# Altium project sensor_board.PrjPcb
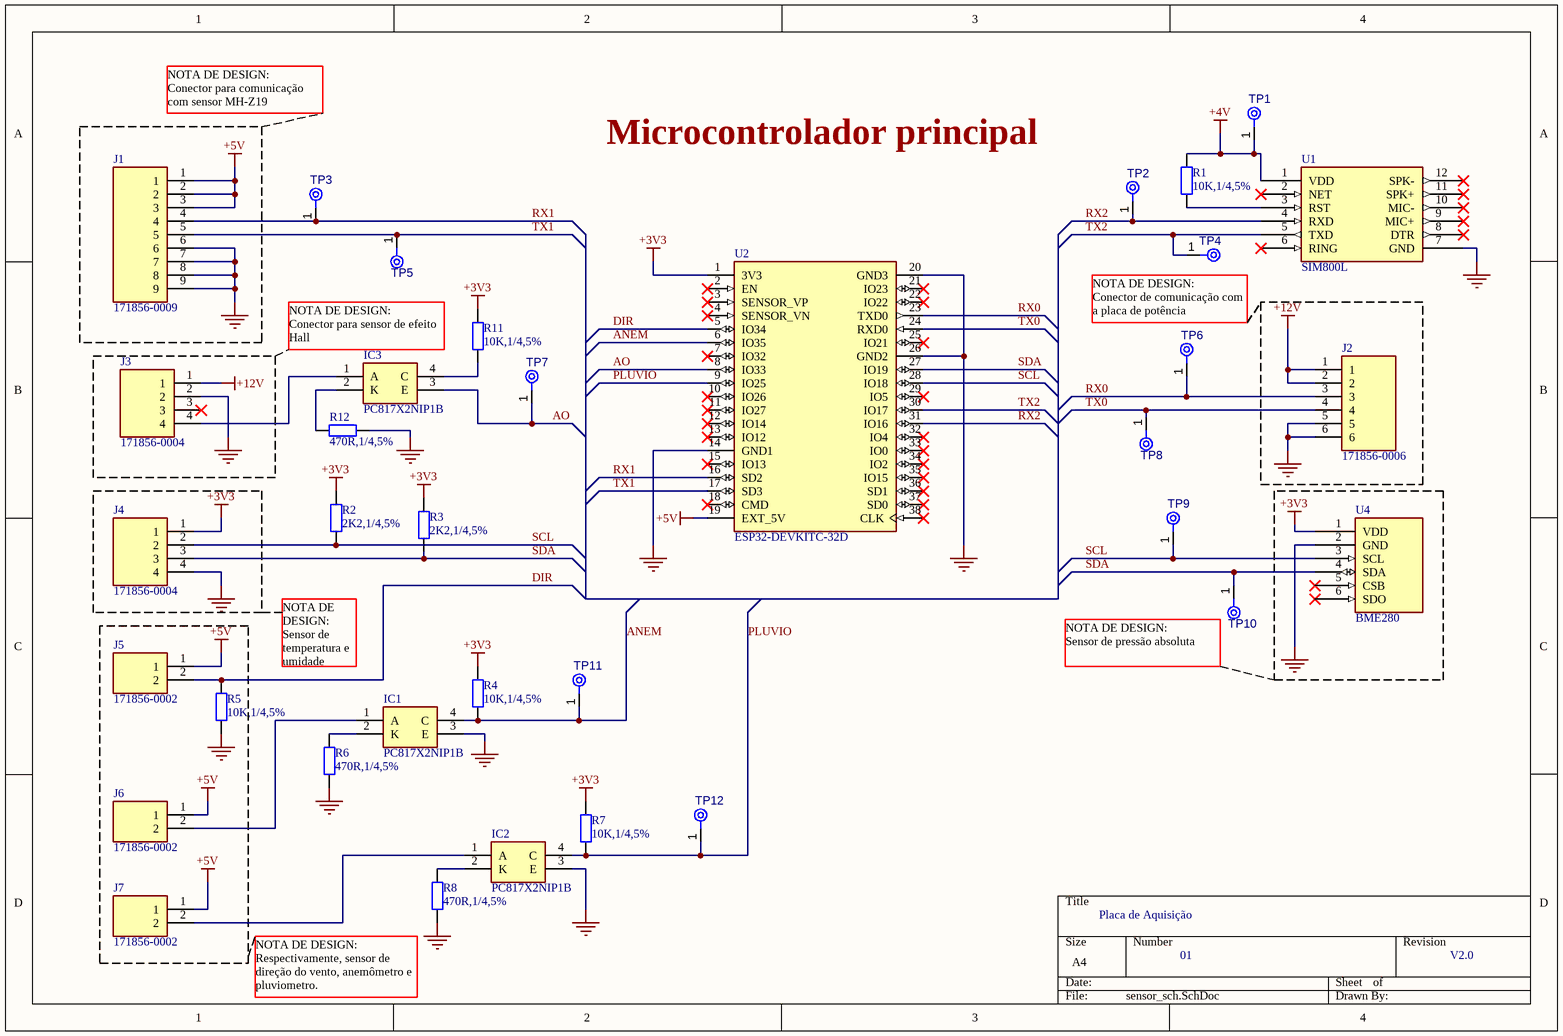
[diagram p0: sensor_sch.SchDoc]
2 sheets, 51 parts. Net scope: global (net labels, ports and power ports of the same name join across sheets).
Board file: sensor_board.PcbDoc
Sheets:
  sensor_sch.SchDoc
  voltage_regulators.SchDoc

## Sheet sensor_sch.SchDoc
size A4; SheetNumber: 1; SheetTotal: 2

### Parts
IC1  PC817X2NIP1B  [SOP254P960X420-4N]
IC2  PC817X2NIP1B  [SOP254P960X420-4N]
IC3  PC817X2NIP1B  [SOP254P960X420-4N]
J1  171856-0009  [SHDR9W99P0X254_1X9_2271X635X818P]
J2  171856-0006  [HDRV6W99P0X254_1X6_1509X635X1100P]
J3  171856-0004  [SHDR4W99P0X254_1X4_1255X635X1124P]
J4  171856-0004  [SHDR4W99P0X254_1X4_1255X635X1124P]
J5  171856-0002  [SHDR2W99P0X254_1X2_493X635X818P]
J6  171856-0002  [SHDR2W99P0X254_1X2_493X635X818P]
J7  171856-0002  [SHDR2W99P0X254_1X2_493X635X818P]
R1  value 10K,1/4,5%  [RESC3216X60N]  (hidden comment: Res2)
R2  value 2K2,1/4,5%  [RESC3216X60N]  (hidden comment: Res2)
R3  value 2K2,1/4,5%  [RESC3216X60N]  (hidden comment: Res2)
R4  value 10K,1/4,5%  [RESC3216X60N]  (hidden comment: Res2)
R5  value 10K,1/4,5%  [RESC3216X60N]  (hidden comment: Res2)
R6  value 470R,1/4,5%  [RESC3216X60N]  (hidden comment: Res2)
R7  value 10K,1/4,5%  [RESC3216X60N]  (hidden comment: Res2)
R8  value 470R,1/4,5%  [RESC3216X60N]  (hidden comment: Res2)
R11  value 10K,1/4,5%  [RESC3216X60N]  (hidden comment: Res2)
R12  value 470R,1/4,5%  [RESC3216X60N]  (hidden comment: Res2)
TP1  TPAD6R  [TP06R]  (value not drawn)  (no BOM)
TP2  TPAD6R  [TP06R]  (value not drawn)  (no BOM)
TP3  TPAD6R  [TP06R]  (value not drawn)  (no BOM)
TP4  TPAD6R  [TP06R]  (value not drawn)  (no BOM)
TP5  TPAD6R  [TP06R]  (value not drawn)  (no BOM)
TP6  TPAD6R  [TP06R]  (value not drawn)  (no BOM)
TP7  TPAD6R  [TP06R]  (value not drawn)  (no BOM)
TP8  TPAD6R  [TP06R]  (value not drawn)  (no BOM)
TP9  TPAD6R  [TP06R]  (value not drawn)  (no BOM)
TP10  TPAD6R  [TP06R]  (value not drawn)  (no BOM)
TP11  TPAD6R  [TP06R]  (value not drawn)  (no BOM)
TP12  TPAD6R  [TP06R]  (value not drawn)  (no BOM)
U1  SIM800L  [SIM800L]
U2  ESP32-DEVKITC-32D  [MODULE_ESP32-DEVKITC-32D]
U4  BME280  [BME280]

### Nets
+3V3: J4.1 R2.2 R3.2 R4.2 R7.2 R11.2 U2.1(3V3) U4.1(VDD)
+4V: R1.2 TP1.1(TP) U1.1(VDD)
+5V: J1.1 J1.2 J1.3 J5.1 J6.1 J7.1 U2.19(EXT_5V)
+12V: J2.1 J2.2 J3.1
GND: IC1.3(E) IC2.3(E) J1.6 J1.7 J1.8 J1.9 J2.5 J2.6 J3.2 J4.4 R5.1 R6.1 R8.1 R12.1 U1.7(GND) U2.14(GND1) U2.20(GND3) U2.26(GND2) U4.2(GND)
ANEM: IC1.4(C) R4.1 TP11.1(TP) U2.6(IO35)
AO: IC3.3(E) TP7.1(TP) U2.8(IO33)
DIR: J5.2 R5.2 U2.5(IO34)
PLUVIO: IC2.4(C) R7.1 TP12.1(TP) U2.9(IO25)
RX0: J2.3 TP6.1(TP) U2.23(TXD0)
RX1: J1.4 TP3.1(TP) U2.16(SD2)
RX2: TP2.1(TP) U1.4(RXD) U2.31(IO16)
SCL: J4.2 R2.1 TP9.1(TP) U2.28(IO18) U4.3(SCL)
SDA: J4.3 R3.1 TP10.1(TP) U2.27(IO19) U4.4(SDA)
TX0: J2.4 TP8.1(TP) U2.24(RXD0)
TX1: J1.5 TP5.1(TP) U2.17(SD3)
TX2: TP4.1(TP) U1.5(TXD) U2.30(IO17)
NetIC1_1: IC1.1(A) J6.2
NetIC1_2: IC1.2(K) R6.2
NetIC2_1: IC2.1(A) J7.2
NetIC2_2: IC2.2(K) R8.2
NetIC3_1: IC3.1(A) J3.4
NetIC3_2: IC3.2(K) R12.2
NetIC3_4: IC3.4(C) R11.1
NetR1_1: R1.1 U1.3(RST)

Not connected (* = marked no-connect by the designer): J3 3*; U1 2(NET)* 6(RING)* 8(DTR)* 9(MIC+)* 10(MIC-)* 11(SPK+)* 12(SPK-)*; U2 2(EN)* 3(SENSOR_VP)* 4(SENSOR_VN)* 7(IO32)* 10(IO26)* 11(IO27)* 12(IO14)* 13(IO12)* 15(IO13)* 18(CMD)* 21(IO23)* 22(IO22)* 25(IO21)* 29(IO5)* 32(IO4)* 33(IO0)* 34(IO2)* 35(IO15)* 36(SD1)* 37(SD0)* 38(CLK)*; U4 5(CSB)* 6(SDO)*

### Notes on the sheet
- NOTA DE DESIGN:
  Conector para comunicação com sensor MH-Z19
- Microcontrolador principal
- NOTA DE DESIGN:
  Conector para sensor de efeito Hall
- (near TP4) NOTA DE DESIGN:
  Conector de comunicação com a placa de potência
- NOTA DE DESIGN:
  Sensor de temperatura e umidade
- (near TP10) NOTA DE DESIGN:
  Sensor de pressão absoluta
- Placa de Aquisição
- 01
- V2.0
- (near R8) NOTA DE DESIGN:
  Respectivamente, sensor de direção do vento, anemômetro e pluviometro.

### Library data of the parts
IC1-IC3 = PC817X2NIP1B: Transistor Output Optocouplers Photocoupler; Manufacturer_Name: Sharp Microelectronics; Manufacturer: Sharp; Datasheet Link: https://global.sharp/products/device/lineup/data/pdf/datasheet/PC817XxNSZ1B_e.pdf; Height: 4.2mm; Manufacturer_Part_Number: PC817X2NIP1B; Mouser Part Number: 852-PC817X2NIP1B; Mouser Price/Stock: https://www.mouser.co.uk/ProductDetail/Sharp-Microelectronics/PC817X2NIP1B?qs=rrS6PyfT74d%252BYyTnGmD7xQ%3D%3D; Arrow Part Number: PC817X2NIP1B; Arrow Price/Stock: https://www.arrow.com/en/products/pc817x2nip1b/sharp; Supplier 1: Mouser; Supplier Part Number 1: 852-PC817X2NIP1B; Manufacturer Part Number: PC817X2NIP1B; RoHS: Yes; Category: Optocouplers; Stock 1: 7; Pricing 1: 1=0.51000, 10=0.33400, 50=0.33400, 100=0.21900, 1000=0.17300, 10000=0.14100 (USD); RoHS Compliant: Yes
J1 = 171856-0009: Headers & Wire Housings KK Hdr Vrt 9 Ckt 2.54mm Pitch Sn; Manufacturer_Name: Molex; Manufacturer Part Number: 1718560009; Current Rating: 4A; Voltage Rating: 250V; Number of Positions: 9; Connector Type: Male Pin; Contact Post Length: 2.34mm; Glow Wire Compliant: Compliant; Datasheet Link: https://www.molex.com/pdm_docs/sd/1718560009_sd.pdf; Height: 8.18mm; Manufacturer_Part_Number: 171856-0009; Mouser Part Number: 538-171856-0009; Mouser Price/Stock: https://www.mouser.com/Search/Refine.aspx?Keyword=538-171856-0009; Supplier 1: Digi-Key; Supplier Part Number 1: WM10186-ND; Manufacturer: Molex; RoHS: Yes; Category: Headers and Wire Housings; Stock 1: 1734; Pricing 1: 1=0.83000, 10=0.68600, 100=0.57150, 1000=0.45717, 5000=0.40002, 10000=0.38002 (USD); Mount: Through Hole; Contact Plating: Tin; Contact Material: Brass; Color: Black; Housing Material: Nylon; Weight: 0.036367oz; Min Operating Temperature: -40°C; Max Operating Temperature: 105°C; Package Quantity: 1000; Number of Rows: 1; Contact Gender: Male; Packaging: Bulk; Fastening Type: Friction; Termination: Solder; Orientation: Vertical; Number of Circuits: 9; Pitch: 2.54mm; Contact Mating Length: 0.293inch; Flammability Rating: UL94 V-2; Halogen Free: Low Halogen; RoHS Compliant: Yes; ComponentLink1URL: https://datasheet.ciiva.com/24242/1718560009-pcb-headers-262932-24242129.pdf?src-supplier=Mouser; ComponentLink1Description: https://datasheet.ciiva.com/24242/1718560009-pcb-headers-262932-24242129.pdf?src-supplier=Mouser
J2 = 171856-0006: Conn Wire to Board HDR 6 POS 2.54mm Solder ST Thru-Hole KK® Bag; Manufacturer_Name: Molex; Current Rating: 4A; Voltage Rating: 250V; Number of Positions: 6; Gender: Male; Connector Type: Male Pin; Contact Post Length: 2.34mm; Glow Wire Compliant: Compliant; Datasheet Link: https://www.molex.com/pdm_docs/sd/1718560006_sd.pdf; Height: 11mm; Manufacturer_Part_Number: 171856-0006; Mouser Part Number: 538-171856-0006; Mouser Price/Stock: https://www.mouser.co.uk/ProductDetail/Molex/171856-0006?qs=s7UCm7gO1bZ%2FF4kPA9T7bA%3D%3D; Supplier 1: Mouser; Supplier Part Number 1: 538-171856-0006; Manufacturer: Molex; Manufacturer Part Number: 171856-0006; RoHS: Yes; Category: Headers and Wire Housings; Stock 1: 7801; Pricing 1: 1=0.52000, 10=0.44100, 50=0.44100, 100=0.34400, 1000=0.27000, 10000=0.22000 (USD); Mount: Through Hole; Contact Plating: Tin,Matte; Contact Material: Brass,Tin; Color: Black; Housing Color: Black; Housing Material: Nylon; Weight: 0.023916oz; Min Operating Temperature: -40°C; Max Operating Temperature: 105°C; Number of Rows: 1; Contact Gender: Male; Packaging: Bulk; Package Quantity: 2000; Fastening Type: Friction; Termination: Solder; Number of Contacts: 6; Orientation: Vertical; Number of Circuits: 6; Length: 15.09mm; Pitch: 2.54mm; Contact Mating Length: 0.293inch; Depth: 6.35mm; Radiation Hardening: No; REACH SVHC: Unknown; Halogen Free: Low Halogen; Flammability Rating: UL94 V-2; RoHS Compliant: Yes; ComponentLink1URL: https://datasheet.ciiva.com/24135/1718560006-pcb-headers-295618-24135976.pdf?src-supplier=Mouser; ComponentLink1Description: https://datasheet.ciiva.com/24135/1718560006-pcb-headers-295618-24135976.pdf?src-supplier=Mouser; ComponentLink2URL: https://datasheet.ciiva.com/30069/162461718560006-pcb-headers-30069863.pdf?src-supplier=Onlinecomponents.com; ComponentLink2Description: https://datasheet.ciiva.com/30069/162461718560006-pcb-headers-30069863.pdf?src-supplier=Onlinecomponents.com; ComponentLink3URL: https://datasheet.ciiva.com/28500/1769843-28500365.pdf?src-supplier=Element14; ComponentLink3Description: https://datasheet.ciiva.com/28500/1769843-28500365.pdf?src-supplier=Element14; ComponentLink4URL: https://datasheet.ciiva.com/30492/0900766b8129e59b-30492739.pdf?src-supplier=RSComponents; ComponentLink4Description: https://datasheet.ciiva.com/30492/0900766b8129e59b-30492739.pdf?src-supplier=RSComponents; ComponentLink5URL: https://datasheet.ciiva.com/29948/1718560002-sd-29948527.pdf?src-supplier=Avnet; ComponentLink5Description: https://datasheet.ciiva.com/29948/1718560002-sd-29948527.pdf?src-supplier=Avnet; ComponentLink6URL: https://datasheet.ciiva.com/30514/70314281-30514598.pdf?src-supplier=Allied+Electronics; ComponentLink6Description: https://datasheet.ciiva.com/30514/70314281-30514598.pdf?src-supplier=Allied+Electronics
J3 J4 = 171856-0004: KK RPC 100 HDR FRLK VERT 04 CKT; Manufacturer: Molex; Manufacturer Part Number: 1718560004; Current Rating: 4A; Voltage Rating: 250V; Number of Positions: 4; Gender: Male; Connector Type: Male Pin; Pitch: 2.54mm; Contact Post Length: 2.34mm; Glow Wire Compliant: Compliant; Supplier 1: Mouser; RoHS: Yes; Category: Headers and Wire Housings; Stock 1: 33104; Pricing 1: 1=0.40000, 10=0.32400, 50=0.32400, 100=0.23800, 1000=0.20000, 10000=0.15600 (USD); Mount: Through Hole; Contact Plating: Tin,Matte; Contact Material: Brass,Tin; Color: Black; Weight: 0.015838oz; Housing Color: Black; Housing Material: Nylon; Min Operating Temperature: -40°C; Max Operating Temperature: 105°C; Number of Rows: 1; Contact Gender: Male; Packaging: Bulk; Package Quantity: 4000; Fastening Type: Friction; Termination: Solder; Number of Contacts: 4; Orientation: Vertical; Number of Circuits: 4; Length: 10.1mm; Contact Mating Length: 0.293inch; Depth: 6.35mm; Radiation Hardening: No; REACH SVHC: Unknown; Halogen Free: Low Halogen; Flammability Rating: UL94 V-2; RoHS Compliant: Yes; ComponentLink1URL: https://datasheet.ciiva.com/24135/1718560004-pcb-headers-295616-24135986.pdf?src-supplier=Mouser; ComponentLink1Description: https://datasheet.ciiva.com/24135/1718560004-pcb-headers-295616-24135986.pdf?src-supplier=Mouser; ComponentLink2URL: https://datasheet.ciiva.com/30102/162471718560004-pcb-headers-30102326.pdf?src-supplier=Onlinecomponents.com; ComponentLink2Description: https://datasheet.ciiva.com/30102/162471718560004-pcb-headers-30102326.pdf?src-supplier=Onlinecomponents.com; ComponentLink3URL: https://datasheet.ciiva.com/30492/0900766b8129e622-30492729.pdf?src-supplier=RSComponents; ComponentLink3Description: https://datasheet.ciiva.com/30492/0900766b8129e622-30492729.pdf?src-supplier=RSComponents; ComponentLink4URL: https://datasheet.ciiva.com/28500/1769844-28500352.pdf?src-supplier=Element14; ComponentLink4Description: https://datasheet.ciiva.com/28500/1769844-28500352.pdf?src-supplier=Element14; ComponentLink5URL: https://datasheet.ciiva.com/29948/1718560002-sd-29948535.pdf?src-supplier=Avnet; ComponentLink5Description: https://datasheet.ciiva.com/29948/1718560002-sd-29948535.pdf?src-supplier=Avnet; ComponentLink6URL: https://datasheet.ciiva.com/29152/1718560002-sd-29152029.pdf?src-supplier=Digi-Key; ComponentLink6Description: https://datasheet.ciiva.com/29152/1718560002-sd-29152029.pdf?src-supplier=Digi-Key; ComponentLink7URL: https://datasheet.ciiva.com/30935/70314280-30935659.pdf?src-supplier=Allied+Electronics; ComponentLink7Description: https://datasheet.ciiva.com/30935/70314280-30935659.pdf?src-supplier=Allied+Electronics; Supplier 2: Mouser; Supplier Part Number 2: 538-171856-0004; Stock 2: 33061; Pricing 2: 1=0.40000, 10=0.32400, 50=0.32400, 100=0.23800, 1000=0.20000, 10000=0.15600 (USD)
J5-J7 = 171856-0002: Conn Wire to Board HDR 2 POS 2.54mm Solder ST Thru-Hole KK® Bag; Manufacturer_Name: Molex; Current Rating: 4A; Voltage Rating: 250V; Number of Positions: 2; Gender: Male; Connector Type: Male Pin; Contact Post Length: 2.34mm; Glow Wire Compliant: Compliant; Datasheet Link: https://www.digikey.com/product-detail/en/molex/1718560002/WM10153-ND/4423109; Height: 8.18mm; Manufacturer_Part_Number: 171856-0002; Mouser Part Number: 538-171856-0002; Mouser Price/Stock: https://www.mouser.co.uk/ProductDetail/Molex/171856-0002?qs=s7UCm7gO1bYKeEMrirBzyw%3D%3D; Arrow Part Number: 171856-0002; Arrow Price/Stock: https://www.arrow.com/en/products/171856-0002/molex; Supplier 1: Mouser; Supplier Part Number 1: 538-171856-0002; Manufacturer: Molex; Manufacturer Part Number: 171856-0002; RoHS: Yes; Category: Headers and Wire Housings; Stock 1: 4493; Pricing 1: 1=0.27000, 10=0.22200, 50=0.22200, 100=0.16300, 1000=0.13000, 10000=0.10000 (USD); Mount: Through Hole; Contact Plating: Tin,Matte; Contact Material: Brass,Tin; Color: Black; Housing Color: Black; Housing Material: Nylon; Weight: 0.007549oz; Min Operating Temperature: -40°C; Max Operating Temperature: 105°C; Number of Rows: 1; Packaging: Bulk; Contact Gender: Male; Package Quantity: 6000; Fastening Type: Friction; Termination: Solder; Number of Contacts: 2; Orientation: Vertical; Number of Circuits: 2; Length: 4.93mm; Pitch: 2.54mm; Contact Mating Length: 0.293inch; Depth: 6.35mm; Radiation Hardening: No; REACH SVHC: Unknown; Halogen Free: Low Halogen; Flammability Rating: UL94 V-2; ComponentLink1URL: https://datasheet.ciiva.com/24135/1718560002-pcb-headers-262931-24135970.pdf?src-supplier=Mouser; ComponentLink1Description: https://datasheet.ciiva.com/24135/1718560002-pcb-headers-262931-24135970.pdf?src-supplier=Mouser; ComponentLink2URL: https://datasheet.ciiva.com/30239/162441718560002-pcb-headers-30239327.pdf?src-supplier=Onlinecomponents.com; ComponentLink2Description: https://datasheet.ciiva.com/30239/162441718560002-pcb-headers-30239327.pdf?src-supplier=Onlinecomponents.com; ComponentLink3URL: https://datasheet.ciiva.com/28500/1769839-28500337.pdf?src-supplier=Element14; ComponentLink3Description: https://datasheet.ciiva.com/28500/1769839-28500337.pdf?src-supplier=Element14; ComponentLink4URL: https://datasheet.ciiva.com/30492/0900766b8129e621-30492725.pdf?src-supplier=RSComponents; ComponentLink4Description: https://datasheet.ciiva.com/30492/0900766b8129e621-30492725.pdf?src-supplier=RSComponents; ComponentLink5URL: https://datasheet.ciiva.com/29152/1718560002-sd-29152023.pdf?src-supplier=Digi-Key; ComponentLink5Description: https://datasheet.ciiva.com/29152/1718560002-sd-29152023.pdf?src-supplier=Digi-Key
R1 R4 R5 R7 R11 = Res2: VISHAY         CRCW120610K0JNEA             RES, THICK FILM, 10K, 5%, 0.25W, 1206, REEL; Manufacturer: Vishay Dale; Resistance: 10kR; Power Rating: 250mW; Voltage Rating: 200V; Temperature Coefficient: 200ppm/°C; Published: 8-Jun-2000; LatestRevisionDate: 17-Jul-2002; LatestRevisionNote: Re-released for DXP Platform.; PackageReference: AXIAL-0.4; Publisher: Altium Limited; PackageDescription: Axial Device, Thru-Hole; 2 Leads; 0.4 in Pin Spacing; Supplier 1: Mouser; Supplier Part Number 1: 71-CRCW1206J-10K-E3; Manufacturer Part Number: CRCW120610K0JNEA; RoHS: Yes; Category: Chip SMD Resistors; Stock 1: 96532; Pricing 1: 1=0.10000, 10=0.06500, 50=0.06500, 100=0.03000, 1000=0.01200, 10000=0.01000 (USD); Case/Package: 1206; Number of Pins: 2; Weight: 0.000353oz; Case Code (Imperial): 1206; Case Code (Metric): 3216; Contact Plating: Tin; Size Code: 1206; Min Operating Temperature: -55°C; Max Operating Temperature: 155°C; Tolerance: 5%; Packaging: Tape and Reel; Package Quantity: 5000; Resistor Type: Thick Film; Termination: SMD/SMT; Voltage Rating (DC): 200V; Features: Automotive AEC-Q200; Series: CRCW; Max Power Dissipation: 250mW; Number of Terminations: 2; Resistance Tolerance: 5%; Construction: Rectangular; Length: 3.2mm; Width: 1.6mm; Height: 0.55mm; Depth: 1.6mm; Radiation Hardening: No; REACH SVHC: Unknown; Military Standard: Not; Lead Free: Lead Free; ComponentLink1URL: https://datasheet.ciiva.com/5546/dcrcwe3-109170-5546729.pdf?src-supplier=Mouser; ComponentLink1Description: https://datasheet.ciiva.com/5546/dcrcwe3-109170-5546729.pdf?src-supplier=Mouser; ComponentLink2URL: https://datasheet.ciiva.com/9050/dcrcwe3-9050936.pdf?src-supplier=Avnet; ComponentLink2Description: https://datasheet.ciiva.com/9050/dcrcwe3-9050936.pdf?src-supplier=Avnet; ComponentLink3URL: https://datasheet.ciiva.com/9050/dcrcwe3-9050939.pdf?src-supplier=Avnet; ComponentLink3Description: https://datasheet.ciiva.com/9050/dcrcwe3-9050939.pdf?src-supplier=Avnet; ComponentLink4URL: https://datasheet.ciiva.com/17190/dcrcwe3-17190266.pdf?src-supplier=Avnet+Europe; ComponentLink4Description: https://datasheet.ciiva.com/17190/dcrcwe3-17190266.pdf?src-supplier=Avnet+Europe; ComponentLink5URL: https://datasheet.ciiva.com/16389/dcrcwe3-16389593.pdf?src-supplier=Future+Electronics; ComponentLink5Description: https://datasheet.ciiva.com/16389/dcrcwe3-16389593.pdf?src-supplier=Future+Electronics; ComponentLink6URL: https://datasheet.ciiva.com/7800/dcrcwe3-7800542.pdf?src-supplier=Element14; ComponentLink6Description: https://datasheet.ciiva.com/7800/dcrcwe3-7800542.pdf?src-supplier=Element14; ComponentLink7URL: https://datasheet.ciiva.com/16724/70201119-16724109.pdf?src-supplier=Allied+Electronics; ComponentLink7Description: https://datasheet.ciiva.com/16724/70201119-16724109.pdf?src-supplier=Allied+Electronics
R2 R3 = Res2: VISHAY   CRCW12062K20JNEA   RES, THICK FILM, 2K2, 5%, 0.25W, 1206, REEL; Manufacturer: Vishay Dale; Resistance: 2.2kR; Power Rating: 250mW; Temperature Coefficient: 200ppm/°C; Voltage Rating: 200V; Published: 8-Jun-2000; LatestRevisionDate: 17-Jul-2002; LatestRevisionNote: Re-released for DXP Platform.; PackageReference: AXIAL-0.4; Publisher: Altium Limited; PackageDescription: Axial Device, Thru-Hole; 2 Leads; 0.4 in Pin Spacing; Supplier 1: Mouser; Supplier Part Number 1: 71-CRCW1206J-2.2K-E3; Manufacturer Part Number: CRCW12062K20JNEA; RoHS: Yes; Category: Chip SMD Resistors; Stock 1: 46; Pricing 1: 1=0.10000, 10=0.05900, 50=0.05900, 100=0.02700, 1000=0.01100, 10000=0.01000 (USD); Mount: Surface Mount; Case/Package: 1206; Contact Plating: Tin; Weight: 0.000353oz; Case Code (Imperial): 1206; Case Code (Metric): 3216; Size Code: 1206; Min Operating Temperature: -55°C; Max Operating Temperature: 155°C; Tolerance: 5%; Resistor Type: Thick Film; Termination: Solder; Package Quantity: 5000; Packaging: Tape and Reel; Voltage Rating (DC): 200V; Features: Automotive AEC-Q200; Series: CRCW; Max Power Dissipation: 250mW; Number of Terminations: 2; Resistance Tolerance: 5%; Technology: THICK FILM; Construction: Rectangular; Length: 3.2mm; Width: 1.6mm; Height: 0.55mm; Depth: 1.6mm; Radiation Hardening: No; Lead Free: Lead Free; RoHS Compliant: Yes; REACH SVHC: Unknown; Military Standard: Not; ComponentLink1URL: https://datasheet.ciiva.com/9091/dcrcwe3-9091080.pdf?src-supplier=Avnet; ComponentLink1Description: https://datasheet.ciiva.com/9091/dcrcwe3-9091080.pdf?src-supplier=Avnet; ComponentLink2URL: https://datasheet.ciiva.com/5543/dcrcwe3-109170-5543996.pdf?src-supplier=Mouser; ComponentLink2Description: https://datasheet.ciiva.com/5543/dcrcwe3-109170-5543996.pdf?src-supplier=Mouser; ComponentLink3URL: https://datasheet.ciiva.com/17201/dcrcwe3-17201852.pdf?src-supplier=Avnet+Europe; ComponentLink3Description: https://datasheet.ciiva.com/17201/dcrcwe3-17201852.pdf?src-supplier=Avnet+Europe; ComponentLink4URL: https://datasheet.ciiva.com/46448/1807946-46448335.pdf?src-supplier=Element14; ComponentLink4Description: https://datasheet.ciiva.com/46448/1807946-46448335.pdf?src-supplier=Element14; ComponentLink5URL: https://datasheet.ciiva.com/16755/70201119-16755609.pdf?src-supplier=Allied+Electronics; ComponentLink5Description: https://datasheet.ciiva.com/16755/70201119-16755609.pdf?src-supplier=Allied+Electronics
R6 R8 R12 = Res2: Thick Film Resistors 1/4watt 470ohms 5%; Manufacturer: Vishay; Manufacturer Part Number: CRCW1206470RJNEAIF; Resistance: 470R; Power Rating: 250mW; Voltage Rating: 200V; Temperature Coefficient: 200ppm/°C; Published: 8-Jun-2000; LatestRevisionDate: 17-Jul-2002; LatestRevisionNote: Re-released for DXP Platform.; PackageReference: AXIAL-0.4; Publisher: Altium Limited; PackageDescription: Axial Device, Thru-Hole; 2 Leads; 0.4 in Pin Spacing; Supplier 1: Mouser; Supplier Part Number 1: 71-CRCW1206470RJNAIF; RoHS: Yes; Category: Chip SMD Resistors; Stock 1: 6264; Pricing 1: 1=0.56000, 10=0.40300, 50=0.40300, 100=0.21000, 1000=0.11300, 10000=0.09500 (USD); Case/Package: 1206; Case Code (Imperial): 1206; Case Code (Metric): 3216; Weight: 0.000353oz; Min Operating Temperature: -55°C; Max Operating Temperature: 155°C; Tolerance: 5%; Packaging: Tape and Reel; Resistor Type: Thick Film; Termination: SMD/SMT; Package Quantity: 5000; Number of Terminations: 2; Max Power Dissipation: 250mW; Voltage Rating (DC): 200V; Features: Automotive AEC-Q200; Series: CRCW-IF; Technology: THICK FILM; Resistance Tolerance: 5%; Construction: Rectangular; Length: 3.2mm; Width: 1.6mm; Height: 0.55mm; Depth: 1.6mm; REACH SVHC: Unknown; Military Standard: Not; Lead Free: Lead Free; RoHS Compliant: Yes; ComponentLink1URL: https://datasheet.ciiva.com/7777/424674-7777482.pdf?src-supplier=Element14; ComponentLink1Description: https://datasheet.ciiva.com/7777/424674-7777482.pdf?src-supplier=Element14; ComponentLink2URL: https://datasheet.ciiva.com/7777/424674-7777483.pdf?src-supplier=Element14; ComponentLink2Description: https://datasheet.ciiva.com/7777/424674-7777483.pdf?src-supplier=Element14
TP1-TP12 = CMP-00028-00002-2: 0.6mm round; Pins: 1
U2 = ESP32-DEVKITC-32D: Espressif Systems ESP32-DevKitC Microcontroller; Frequency: 2.5GHz; Interface: USB; Operating Supply Voltage: 5V; Value: *; MP: ESP32-DEVKITC-32D; Price: None; Check_prices: https://www.snapeda.com/parts/ESP32-DEVKITC-32D/Espressif%20Systems/view-part/2777395/?ref=eda; MF: Espressif Systems; SnapEDA_Link: https://www.snapeda.com/parts/ESP32-DEVKITC-32D/Espressif%20Systems/view-part/2777395/?ref=snap; Availability: Warning; Purchase-URL: https://pricing.snapeda.com/search/part/ESP32-DEVKITC-32D/?ref=eda; Package: None; Supplier 1: Mouser; Supplier Part Number 1: 356-ESP32-DEVKITC32D; Manufacturer: Espressif Systems; Manufacturer Part Number: ESP32-DEVKITC-32D; RoHS: No; Stock 1: 1545; Pricing 1: 1=10.00000, 10=10.00000, 50=10.00000, 100=10.00000, 1000=10.00000, 10000=10.00000 (USD); Package Quantity: 1; ComponentLink1URL: https://datasheet.ciiva.com/70828/esp32-devkit-70828764.pdf?src-supplier=TME; ComponentLink1Description: https://datasheet.ciiva.com/70828/esp32-devkit-70828764.pdf?src-supplier=TME
U4 = BME280: Digital Pressure Sensor

## Sheet voltage_regulators.SchDoc
size A4; SheetNumber: 2; SheetTotal: 2
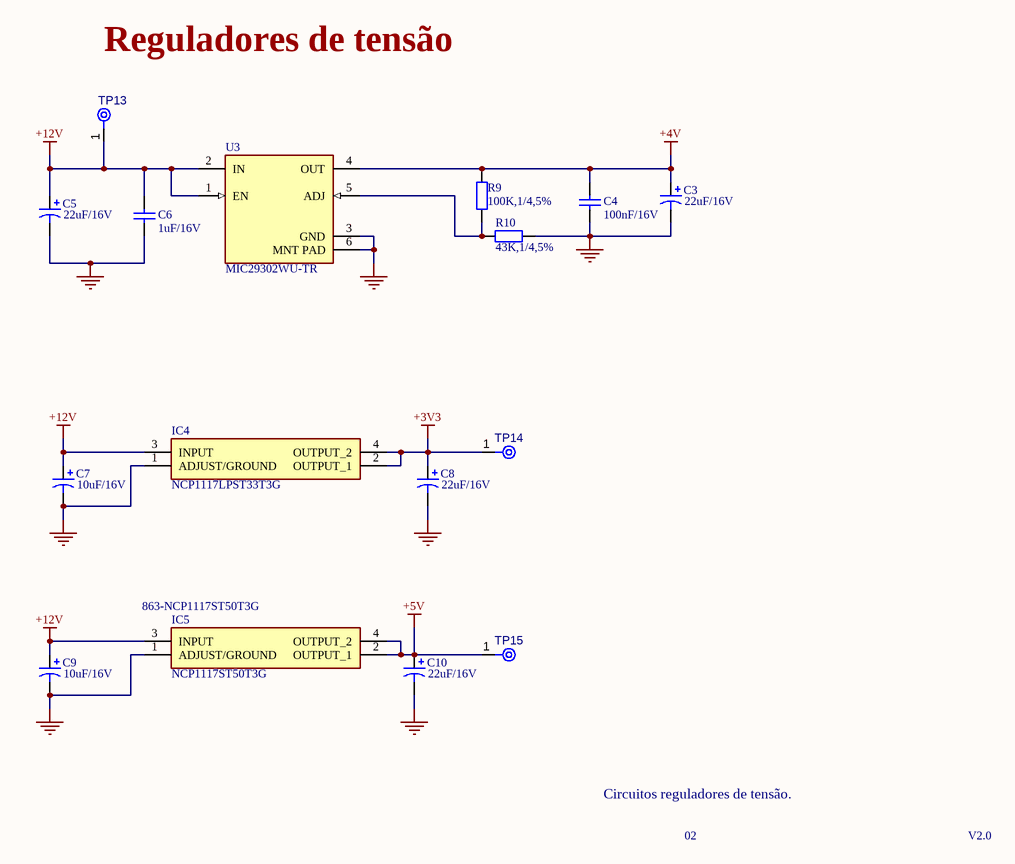
[diagram p1: voltage_regulators.SchDoc]

### Parts
C3  value 22uF/16V  [CAPPM3216X180N]  (hidden comment: Cap Pol3)
C4  value 100nF/16V  [C1206]  (hidden comment: Cap Semi)
C5  value 22uF/16V  [CAPPM3216X180N]  (hidden comment: Cap Pol3)
C6  value 1uF/16V  [C1206]  (hidden comment: Cap Semi)
C7  value 10uF/16V  [CAPPM3216X180N]  (hidden comment: Cap Pol3)
C8  value 22uF/16V  [CAPPM3216X180N]  (hidden comment: Cap Pol3)
C9  value 10uF/16V  [CAPPM3216X180N]  (hidden comment: Cap Pol3)
C10  value 22uF/16V  [CAPPM3216X180N]  (hidden comment: Cap Pol3)
IC4  NCP1117LPST33T3G  [SOT230P700X180-4N]
IC5  NCP1117ST50T3G  Supplier Part Number 2: 863-NCP1117ST50T3G  [SOT230P700X180-4N]
R9  value 100K,1/4,5%  [RESC3216X60N]  (hidden comment: Res2)
R10  value 43K,1/4,5%  [RESC3216X60N]  (hidden comment: Res2)
TP13  TPAD6R  [TP06R]  (value not drawn)  (no BOM)
TP14  TPAD6R  [TP06R]  (value not drawn)  (no BOM)
TP15  TPAD6R  [TP06R]  (value not drawn)  (no BOM)
U3  MIC29302WU-TR  [FP-C04-012-MFG]

### Nets
+3V3: C8.1 IC4.2(OUTPUT_1) IC4.4(OUTPUT_2) TP14.1(TP)
+4V: C3.1 C4.2 R9.2 U3.4(OUT)
+5V: C10.1 IC5.2(OUTPUT_1) IC5.4(OUTPUT_2) TP15.1(TP)
+12V: C5.1 C6.2 C7.1 C9.1 IC4.3(INPUT) IC5.3(INPUT) TP13.1(TP) U3.1(EN) U3.2(IN)
GND: C3.2 C4.1 C5.2 C6.1 C7.2 C8.2 C9.2 C10.2 IC4.1(ADJUST/GROUND) IC5.1(ADJUST/GROUND) R10.1 U3.3(GND) U3.6(MNT_PAD)
NetR9_1: R9.1 R10.2 U3.5(ADJ)

### Notes on the sheet
- Reguladores de tensão
- Circuitos reguladores de tensão.
- 02
- V2.0

### Library data of the parts
C3 C5 C8 C10 = Cap Pol3: Polarized Capacitor (Surface Mount); Manufacturer: KEMET; Manufacturer Part Number: TF08A226M016APE200; Published: 8-Jun-2000; LatestRevisionDate: 29-May-2009; LatestRevisionNote: IPC-7351 Footprint Added.; PackageReference: C0805; Publisher: Altium Limited; PackageDescription: Chip Capacitor; Supplier 1: Mouser; Supplier Part Number 1: 80-TF08A226M16APE200; RoHS: Yes; Stock 1: 1247; Pricing 1: 1=1.80000, 10=1.31000, 50=1.31000, 100=0.96000, 1000=0.65400, 10000=0.65400 (USD)
C4 = Cap Semi: Capacitor (Semiconductor SIM Model); Manufacturer: KEMET; Manufacturer Part Number: C1206X104G4HACTU; Published: 8-Jun-2000; LatestRevisionDate: 29-May-2009; LatestRevisionNote: IPC-7351 Footprint Added.; PackageReference: C1206; Publisher: Altium Limited; PackageDescription: Chip Capacitor; Supplier 1: Mouser; Supplier Part Number 1: 80-C1206X104G4HACTU; RoHS: Yes; Category: Capacitors; Stock 1: 2013; Pricing 1: 1=1.11000, 10=0.78000, 50=0.78000, 100=0.50000, 1000=0.39500, 10000=0.28500 (USD); RoHS Compliant: Yes
C6 = Cap Semi: CAP CER 1206 1UF 16V X7R 10%; Manufacturer: KEMET; Manufacturer Part Number: C1206C105K4REC7210; Published: 8-Jun-2000; LatestRevisionDate: 29-May-2009; LatestRevisionNote: IPC-7351 Footprint Added.; PackageReference: C1206; Publisher: Altium Limited; PackageDescription: Chip Capacitor; Supplier 1: Mouser; Supplier Part Number 1: 80-C1206C105K4RECLR; RoHS: Yes; Category: Ceramic Capacitors; Stock 1: 8446; Pricing 1: 1=0.34000, 10=0.20000, 50=0.20000, 100=0.12000, 1000=0.10300, 10000=0.07000 (USD); RoHS Compliant: Yes; ComponentLink1URL: https://api.kemet.com/component-edge/download/datasheet/C1206C105K4REC7210.pdf?src-supplier=Digi-Key; ComponentLink1Description: https://api.kemet.com/component-edge/download/datasheet/C1206C105K4REC7210.pdf?src-supplier=Digi-Key
C7 C9 = Cap Pol3: AVX - TCJA106M016R0200 - Tantalum Polymer Capacitor, 10 µF, 16 V, TCJ Series, ± 20%, A, 0.2 ohm; Manufacturer: Kyocera AVX; Capacitance: 10uF; ESR (Equivalent Series Resistance): 200mR; Voltage Rating: 16V; Leakage Current: 16uA; Polarity: Polar; Dissipation Factor: 6%; Published: 8-Jun-2000; LatestRevisionDate: 29-May-2009; LatestRevisionNote: IPC-7351 Footprint Added.; PackageReference: C0805; Publisher: Altium Limited; PackageDescription: Chip Capacitor; Supplier 1: Mouser; Supplier Part Number 1: 581-TCJA106M16R200; Manufacturer Part Number: TCJA106M016R0200; RoHS: Yes; Category: Tantalum Capacitors; Stock 1: 21788; Pricing 1: 1=0.71000, 10=0.52200, 50=0.52200, 100=0.35800, 1000=0.23800, 10000=0.18800 (USD); Mount: Surface Mount,PCB; Case/Package: 1206; Number of Pins: 2; Case Code (Imperial): 1206; Case Code (Metric): 3216; Dielectric Material: Tantalum; Min Operating Temperature: -55°C; Max Operating Temperature: 125°C; Tolerance: 20%; Packaging: Tape and Reel; Package Quantity: 1; Voltage Rating (DC): 16V; Termination: SMD/SMT; Voltage: 16V; Length: 3.2mm; Width: 1.6mm; Height: 1.6mm; Height - Seated (Max): 0.071inch; Depth: 1.6mm; Radiation Hardening: No; REACH SVHC: No SVHC; Lead Free: Lead Free; RoHS Compliant: Yes; ComponentLink1URL: https://datasheet.ciiva.com/11793/0900766b80eff593-11793323.pdf?src-supplier=RSComponents; ComponentLink1Description: https://datasheet.ciiva.com/11793/0900766b80eff593-11793323.pdf?src-supplier=RSComponents; ComponentLink2URL: https://datasheet.ciiva.com/22706/1805435-22706880.pdf?src-supplier=Element14; ComponentLink2Description: https://datasheet.ciiva.com/22706/1805435-22706880.pdf?src-supplier=Element14; ComponentLink3URL: https://datasheet.ciiva.com/264/tcj-264055.pdf?src-supplier=Digi-Key; ComponentLink3Description: https://datasheet.ciiva.com/264/tcj-264055.pdf?src-supplier=Digi-Key; ComponentLink4URL: https://datasheet.ciiva.com/264/tcj-264056.pdf?src-supplier=Digi-Key; ComponentLink4Description: https://datasheet.ciiva.com/264/tcj-264056.pdf?src-supplier=Digi-Key; ComponentLink5URL: https://datasheet.ciiva.com/264/tcj-264057.pdf?src-supplier=Digi-Key; ComponentLink5Description: https://datasheet.ciiva.com/264/tcj-264057.pdf?src-supplier=Digi-Key; ComponentLink6URL: https://datasheet.ciiva.com/11230/tcj-11230524.pdf?src-supplier=Avnet; ComponentLink6Description: https://datasheet.ciiva.com/11230/tcj-11230524.pdf?src-supplier=Avnet; ComponentLink7URL: https://datasheet.ciiva.com/16493/tcj-16493481.pdf?src-supplier=Future+Electronics; ComponentLink7Description: https://datasheet.ciiva.com/16493/tcj-16493481.pdf?src-supplier=Future+Electronics; ComponentLink8URL: https://datasheet.ciiva.com/14593/70001813-14593228.pdf?src-supplier=Allied+Electronics; ComponentLink8Description: https://datasheet.ciiva.com/14593/70001813-14593228.pdf?src-supplier=Allied+Electronics; ComponentLink9URL: https://datasheet.ciiva.com/7730/1805435-7730829.pdf?src-supplier=Element14; ComponentLink9Description: https://datasheet.ciiva.com/7730/1805435-7730829.pdf?src-supplier=Element14; ComponentLink10URL: https://datasheet.ciiva.com/7730/1805435-7730830.pdf?src-supplier=Element14; ComponentLink10Description: https://datasheet.ciiva.com/7730/1805435-7730830.pdf?src-supplier=Element14; ComponentLink11URL: https://datasheet.ciiva.com/7730/1805435-7730831.pdf?src-supplier=Element14; ComponentLink11Description: https://datasheet.ciiva.com/7730/1805435-7730831.pdf?src-supplier=Element14; ComponentLink12URL: https://datasheet.ciiva.com/14596/70001813-14596970.pdf?src-supplier=Allied+Electronics; ComponentLink12Description: https://datasheet.ciiva.com/14596/70001813-14596970.pdf?src-supplier=Allied+Electronics
IC4 = NCP1117ST33T3G: ON SEMICONDUCTOR - NCP1117LPST33T3G - Fixed LDO Voltage Regulator, 18V in, 1.3V Dropout, 3.3V/1A out, SOT-223-3; Number of Outputs: 1; Min Input Voltage: -300mV; Output Voltage: 3.3V; Max Output Current: 1A; Min Current Limit: 1.1A; Quiescent Current: 700uA; Reference Voltage: 1.275V; Polarity: Positive; Power Supply Rejection Ratio (PSRR): 60dB; Supplier 1: Mouser; Supplier Part Number 1: 863-NCP1117LPST33T3G; Manufacturer: ON Semiconductor; Manufacturer Part Number: NCP1117LPST33T3G; RoHS: Yes; Category: Voltage Regulators - Linear; Stock 1: 1680; Pricing 1: 1=0.49000, 10=0.36000, 50=0.36000, 100=0.24300, 1000=0.15100, 10000=0.12100 (USD); Mount: Surface Mount; Case/Package: SOT-223; Number of Pins: 3; Contact Plating: Tin,Matte; Min Operating Temperature: 0°C; Max Operating Temperature: 125°C; Dropout Voltage: 1.3V; Packaging: Tape and Reel; Package Quantity: 1; Max Input Voltage: 18V; Output Current: 1A; Number of Regulators: 1; Min Output Voltage: 3.3V; Nominal Output Voltage: 3.3V; Output Type: Fixed; Series: -; Length: 6.7mm; Width: 3.7mm; Height: 1.69mm; REACH SVHC: No SVHC; Lead Free: Lead Free; Halogen Free: Halogen Free; RoHS Compliant: Yes; ComponentLink1URL: https://datasheet.ciiva.com/8231/ncp1117lp-d-8231034.pdf?src-supplier=Avnet; ComponentLink1Description: https://datasheet.ciiva.com/8231/ncp1117lp-d-8231034.pdf?src-supplier=Avnet; ComponentLink2URL: https://datasheet.ciiva.com/8233/ncp1117lp-d-8233561.pdf?src-supplier=Avnet; ComponentLink2Description: https://datasheet.ciiva.com/8233/ncp1117lp-d-8233561.pdf?src-supplier=Avnet; ComponentLink3URL: https://datasheet.ciiva.com/6590/ncp1117lp-d-6590870.pdf?src-supplier=Digi-Key; ComponentLink3Description: https://datasheet.ciiva.com/6590/ncp1117lp-d-6590870.pdf?src-supplier=Digi-Key; ComponentLink4URL: https://datasheet.ciiva.com/6590/ncp1117lp-d-6590872.pdf?src-supplier=Digi-Key; ComponentLink4Description: https://datasheet.ciiva.com/6590/ncp1117lp-d-6590872.pdf?src-supplier=Digi-Key; ComponentLink5URL: https://datasheet.ciiva.com/6590/ncp1117lp-d-6590873.pdf?src-supplier=Digi-Key; ComponentLink5Description: https://datasheet.ciiva.com/6590/ncp1117lp-d-6590873.pdf?src-supplier=Digi-Key; ComponentLink6URL: https://datasheet.ciiva.com/4887/ncp1117lp-d-82673-4887580.pdf?src-supplier=Mouser; ComponentLink6Description: https://datasheet.ciiva.com/4887/ncp1117lp-d-82673-4887580.pdf?src-supplier=Mouser; ComponentLink7URL: https://datasheet.ciiva.com/16468/ncp1117lp-d-16468566.pdf?src-supplier=Future+Electronics; ComponentLink7Description: https://datasheet.ciiva.com/16468/ncp1117lp-d-16468566.pdf?src-supplier=Future+Electronics
IC5 = NCP1117ST50T3G: ON SEMICONDUCTOR - NCP1117ST50T3G - Fixed LDO Voltage Regulator, 3.5V to 20V, 1.07V Dropout, 5Vout, 1Aout, SOT-223-3; Manufacturer Part Number: NCP1117ST33T3G; Output Voltage: 3.3V; Number of Outputs: 1; Output Current: 1A; Max Supply Voltage: 15V; Min Supply Voltage: 4.75V; Input Bias Current: 6mA; Quiescent Current: 10mA; Polarity: Positive; Reference Voltage: 1.25V; Accuracy: 1%; Power Rating: 781mW; Datasheet Link: http://www.onsemi.com/pub/Collateral/NCP1117-D.PDF; Height: 1.8mm; Manufacturer_Name: ON Semiconductor; Manufacturer_Part_Number: NCP1117ST50T3G; Mouser Part Number: 863-NCP1117ST50T3G; Mouser Price/Stock: https://www.mouser.co.uk/ProductDetail/ON-Semiconductor/NCP1117ST50T3G/?qs=Gev%252BmEvV0ib6dijy6U0dhQ%3D%3D; Arrow Part Number: NCP1117ST50T3G; Arrow Price/Stock: https://www.arrow.com/en/products/ncp1117st50t3g/on-semiconductor; Supplier 1: Mouser; Supplier Part Number 1: 863-NCP1117ST33T3G; Manufacturer: ON Semiconductor; RoHS: Yes; Category: Voltage Regulators - Linear; Pricing 1: 1=0.56000, 10=0.47900, 50=0.47900, 100=0.33200, 1000=0.21700, 10000=0.17400 (USD); Mount: Surface Mount; Case/Package: SOT-223; Number of Pins: 3; Contact Plating: Tin,Matte; Min Operating Temperature: 0°C; Max Operating Temperature: 125°C; Max Input Voltage: 20V; Packaging: Tape and Reel; Dropout Voltage: 1.07V; Max Output Current: 1A; Package Quantity: 1; Min Input Voltage: 3.5V; Nominal Output Voltage: 3.3V; Number of Regulators: 1; Min Current Limit: 1A; Min Output Voltage: 3.3V; Max Output Voltage: 3.3V; Termination: SMD/SMT; Output Voltage Accuracy: 1%; Output Type: Fixed; Length: 6.7mm; Width: 3.7mm; Radiation Hardening: No; REACH SVHC: No SVHC; Lead Free: Lead Free; Halogen Free: Halogen Free; RoHS Compliant: Yes; ComponentLink1URL: https://datasheet.ciiva.com/3224/ncp1117-d-3224144.pdf?src-supplier=Avnet; ComponentLink1Description: https://datasheet.ciiva.com/3224/ncp1117-d-3224144.pdf?src-supplier=Avnet; ComponentLink2URL: https://datasheet.ciiva.com/15111/getdatasheetpartid-82718-15111483.pdf?src-supplier=Verical; ComponentLink2Description: https://datasheet.ciiva.com/15111/getdatasheetpartid-82718-15111483.pdf?src-supplier=Verical; ComponentLink3URL: https://datasheet.ciiva.com/22697/1726422-22697602.pdf?src-supplier=Element14; ComponentLink3Description: https://datasheet.ciiva.com/22697/1726422-22697602.pdf?src-supplier=Element14; ComponentLink4URL: https://datasheet.ciiva.com/2042/ncp1117-d-2042027.pdf?src-supplier=Digi-Key; ComponentLink4Description: https://datasheet.ciiva.com/2042/ncp1117-d-2042027.pdf?src-supplier=Digi-Key; ComponentLink5URL: https://datasheet.ciiva.com/2042/ncp1117-d-2042028.pdf?src-supplier=Digi-Key; ComponentLink5Description: https://datasheet.ciiva.com/2042/ncp1117-d-2042028.pdf?src-supplier=Digi-Key; ComponentLink6URL: https://datasheet.ciiva.com/2042/ncp1117-d-2042029.pdf?src-supplier=Digi-Key; ComponentLink6Description: https://datasheet.ciiva.com/2042/ncp1117-d-2042029.pdf?src-supplier=Digi-Key; ComponentLink7URL: https://datasheet.ciiva.com/8233/ncp1117-d-8233589.pdf?src-supplier=Avnet; ComponentLink7Description: https://datasheet.ciiva.com/8233/ncp1117-d-8233589.pdf?src-supplier=Avnet; ComponentLink8URL: https://datasheet.ciiva.com/8073/1726422-8073735.pdf?src-supplier=Element14; ComponentLink8Description: https://datasheet.ciiva.com/8073/1726422-8073735.pdf?src-supplier=Element14; ComponentLink9URL: https://datasheet.ciiva.com/28483/1748260-28483307.pdf?src-supplier=Element14; ComponentLink9Description: https://datasheet.ciiva.com/28483/1748260-28483307.pdf?src-supplier=Element14; ComponentLink10URL: https://datasheet.ciiva.com/16382/ncp1117-d-16382636.pdf?src-supplier=Future+Electronics; ComponentLink10Description: https://datasheet.ciiva.com/16382/ncp1117-d-16382636.pdf?src-supplier=Future+Electronics; Supplier 2: Mouser; Stock 2: 142; Pricing 2: 1=0.48000, 10=0.38400, 50=0.38400, 100=0.28500, 1000=0.18700, 10000=0.15200 (USD); Tolerance: 1%; ComponentLink11URL: https://datasheet.ciiva.com/28483/1748260-28483320.pdf?src-supplier=Element14; ComponentLink11Description: https://datasheet.ciiva.com/28483/1748260-28483320.pdf?src-supplier=Element14; ComponentLink12URL: https://datasheet.ciiva.com/2042/ncp1117-d-2042018.pdf?src-supplier=Digi-Key; ComponentLink12Description: https://datasheet.ciiva.com/2042/ncp1117-d-2042018.pdf?src-supplier=Digi-Key; ComponentLink13URL: https://datasheet.ciiva.com/2042/ncp1117-d-2042019.pdf?src-supplier=Digi-Key; ComponentLink13Description: https://datasheet.ciiva.com/2042/ncp1117-d-2042019.pdf?src-supplier=Digi-Key; ComponentLink14URL: https://datasheet.ciiva.com/2042/ncp1117-d-2042020.pdf?src-supplier=Digi-Key; ComponentLink14Description: https://datasheet.ciiva.com/2042/ncp1117-d-2042020.pdf?src-supplier=Digi-Key; ComponentLink15URL: https://datasheet.ciiva.com/8231/ncp1117-d-8231068.pdf?src-supplier=Avnet; ComponentLink15Description: https://datasheet.ciiva.com/8231/ncp1117-d-8231068.pdf?src-supplier=Avnet; ComponentLink16URL: https://datasheet.ciiva.com/8233/ncp1117-d-8233593.pdf?src-supplier=Avnet; ComponentLink16Description: https://datasheet.ciiva.com/8233/ncp1117-d-8233593.pdf?src-supplier=Avnet; ComponentLink17URL: https://datasheet.ciiva.com/16491/ncp1117-d-16491895.pdf?src-supplier=Avnet+Asia; ComponentLink17Description: https://datasheet.ciiva.com/16491/ncp1117-d-16491895.pdf?src-supplier=Avnet+Asia; ComponentLink18URL: https://datasheet.ciiva.com/16209/ncp1117-d-16209561.pdf?src-supplier=Future+Electronics; ComponentLink18Description: https://datasheet.ciiva.com/16209/ncp1117-d-16209561.pdf?src-supplier=Future+Electronics; ComponentLink19URL: https://datasheet.ciiva.com/8073/ncp1117-d-8073736.pdf?src-supplier=Element14; ComponentLink19Description: https://datasheet.ciiva.com/8073/ncp1117-d-8073736.pdf?src-supplier=Element14; ComponentLink20URL: https://datasheet.ciiva.com/8073/ncp1117-d-8073902.pdf?src-supplier=Element14; ComponentLink20Description: https://datasheet.ciiva.com/8073/ncp1117-d-8073902.pdf?src-supplier=Element14; ComponentLink21URL: https://datasheet.ciiva.com/25978/ncp1117-d-25978293.pdf?src-supplier=Avnet+Europe; ComponentLink21Description: https://datasheet.ciiva.com/25978/ncp1117-d-25978293.pdf?src-supplier=Avnet+Europe
R9 = Res2: RES SMD 100K OHM 5% 1/4W 1206; Manufacturer: Vishay Dale; Manufacturer Part Number: CRCW1206100KJNEA; Resistance: 100kR; Temperature Coefficient: 200ppm/°C; Power Rating: 250mW; Voltage Rating: 200V; Published: 8-Jun-2000; LatestRevisionDate: 17-Jul-2002; LatestRevisionNote: Re-released for DXP Platform.; PackageReference: AXIAL-0.4; Publisher: Altium Limited; PackageDescription: Axial Device, Thru-Hole; 2 Leads; 0.4 in Pin Spacing; Supplier 1: Mouser; Supplier Part Number 1: 71-CRCW1206J-100K-E3; RoHS: Yes; Category: Chip SMD Resistors; Stock 1: 17942; Pricing 1: 1=0.10000, 10=0.06600, 50=0.06600, 100=0.02700, 1000=0.01100, 10000=0.01100 (USD); Mount: Surface Mount; Case/Package: 1206; Number of Pins: 2; Case Code (Metric): 3216; Case Code (Imperial): 1206; Contact Plating: Tin; Weight: 0.000353oz; Size Code: 1206; Min Operating Temperature: -55°C; Max Operating Temperature: 155°C; Tolerance: 5%; Resistor Type: Thick Film; Packaging: Tape and Reel; Number of Terminations: 2; Max Power Dissipation: 250mW; Features: Automotive AEC-Q200; Series: CRCW; Package Quantity: 1; Termination: SMD/SMT; Voltage Rating (DC): 200V; Resistance Tolerance: 5%; Construction: Rectangular; Length: 3.2mm; Width: 0.063inch; Height: 0.024inch; Depth: 1.6mm; Radiation Hardening: No; Lead Free: Lead Free; RoHS Compliant: Yes; REACH SVHC: Unknown; Military Standard: Not; ComponentLink1URL: https://datasheet.ciiva.com/7107/1747939-7107664.pdf?src-supplier=Newark; ComponentLink1Description: https://datasheet.ciiva.com/7107/1747939-7107664.pdf?src-supplier=Newark; ComponentLink2URL: https://datasheet.ciiva.com/2468/dcrcwe3-2468223.pdf?src-supplier=Digi-Key; ComponentLink2Description: https://datasheet.ciiva.com/2468/dcrcwe3-2468223.pdf?src-supplier=Digi-Key; ComponentLink3URL: https://datasheet.ciiva.com/2468/dcrcwe3-2468224.pdf?src-supplier=Digi-Key; ComponentLink3Description: https://datasheet.ciiva.com/2468/dcrcwe3-2468224.pdf?src-supplier=Digi-Key; ComponentLink4URL: https://datasheet.ciiva.com/2468/dcrcwe3-2468225.pdf?src-supplier=Digi-Key; ComponentLink4Description: https://datasheet.ciiva.com/2468/dcrcwe3-2468225.pdf?src-supplier=Digi-Key; ComponentLink5URL: https://datasheet.ciiva.com/5548/dcrcwe3-109170-5548556.pdf?src-supplier=Mouser; ComponentLink5Description: https://datasheet.ciiva.com/5548/dcrcwe3-109170-5548556.pdf?src-supplier=Mouser; ComponentLink6URL: https://datasheet.ciiva.com/28621/1747939-28621479.pdf?src-supplier=Element14; ComponentLink6Description: https://datasheet.ciiva.com/28621/1747939-28621479.pdf?src-supplier=Element14; ComponentLink7URL: https://datasheet.ciiva.com/8979/dcrcwe3-8979863.pdf?src-supplier=Avnet; ComponentLink7Description: https://datasheet.ciiva.com/8979/dcrcwe3-8979863.pdf?src-supplier=Avnet; ComponentLink8URL: https://datasheet.ciiva.com/8979/dcrcwe3-8979869.pdf?src-supplier=Avnet; ComponentLink8Description: https://datasheet.ciiva.com/8979/dcrcwe3-8979869.pdf?src-supplier=Avnet; ComponentLink9URL: https://datasheet.ciiva.com/15159/getdatasheetpartid-45729-15159543.pdf?src-supplier=Verical; ComponentLink9Description: https://datasheet.ciiva.com/15159/getdatasheetpartid-45729-15159543.pdf?src-supplier=Verical; ComponentLink10URL: https://datasheet.ciiva.com/16755/70201119-16755608.pdf?src-supplier=Allied+Electronics; ComponentLink10Description: https://datasheet.ciiva.com/16755/70201119-16755608.pdf?src-supplier=Allied+Electronics; ComponentLink11URL: https://datasheet.ciiva.com/16765/70201119-16765961.pdf?src-supplier=Allied+Electronics; ComponentLink11Description: https://datasheet.ciiva.com/16765/70201119-16765961.pdf?src-supplier=Allied+Electronics
R10 = Res2: RES SMD 43K OHM 5% 1/4W 1206; Manufacturer: Vishay Dale; Manufacturer Part Number: CRCW120643K0JNEA; Resistance: 43kR; Max Power Dissipation: 250mW; Temperature Coefficient: 200ppm/°C; Voltage Rating: 200V; Published: 8-Jun-2000; LatestRevisionDate: 17-Jul-2002; LatestRevisionNote: Re-released for DXP Platform.; PackageReference: AXIAL-0.4; Publisher: Altium Limited; PackageDescription: Axial Device, Thru-Hole; 2 Leads; 0.4 in Pin Spacing; Supplier 1: Mouser; Supplier Part Number 1: 71-CRCW1206J-43K-E3; RoHS: Yes; Category: Chip SMD Resistors; Stock 1: 26455; Pricing 1: 1=0.10000, 10=0.07200, 50=0.07200, 100=0.03200, 1000=0.01600, 10000=0.00800 (USD); Case/Package: 1206; Case Code (Metric): 3216; Case Code (Imperial): 1206; Contact Plating: Tin; Weight: 0.000353oz; Min Operating Temperature: -55°C; Max Operating Temperature: 155°C; Tolerance: 5%; Packaging: Tape and Reel; Package Quantity: 1; Resistor Type: Thick Film; Number of Terminations: 2; Features: Automotive AEC-Q200; Series: CRCW; Power Rating: 250mW; Termination: SMD/SMT; Voltage Rating (DC): 200V; Construction: Rectangular; Length: 3.2mm; Width: 0.063inch; Height: 0.024inch; Depth: 1.6mm; Lead Free: Lead Free; RoHS Compliant: Yes; Military Standard: Not; ComponentLink1URL: https://datasheet.ciiva.com/5542/dcrcwe3-109170-5542254.pdf?src-supplier=Mouser; ComponentLink1Description: https://datasheet.ciiva.com/5542/dcrcwe3-109170-5542254.pdf?src-supplier=Mouser; ComponentLink2URL: https://datasheet.ciiva.com/9008/dcrcwe3-9008908.pdf?src-supplier=Avnet; ComponentLink2Description: https://datasheet.ciiva.com/9008/dcrcwe3-9008908.pdf?src-supplier=Avnet; ComponentLink3URL: https://datasheet.ciiva.com/2496/dcrcwe3-2496505.pdf?src-supplier=Digi-Key; ComponentLink3Description: https://datasheet.ciiva.com/2496/dcrcwe3-2496505.pdf?src-supplier=Digi-Key; ComponentLink4URL: https://datasheet.ciiva.com/2496/dcrcwe3-2496506.pdf?src-supplier=Digi-Key; ComponentLink4Description: https://datasheet.ciiva.com/2496/dcrcwe3-2496506.pdf?src-supplier=Digi-Key; ComponentLink5URL: https://datasheet.ciiva.com/2496/dcrcwe3-2496507.pdf?src-supplier=Digi-Key; ComponentLink5Description: https://datasheet.ciiva.com/2496/dcrcwe3-2496507.pdf?src-supplier=Digi-Key
TP13-TP15 = CMP-00028-00002-2: 0.6mm round; Pins: 1
U3 = CMP-06324-000007-1: IC REG LINEAR POS ADJ 3A TO263-5; Manufacturer: Microchip; Output Voltage: 3.3-12V; Output Type: AdjustableProgrammable; Max Junction Temp: +125°C; Standoff Height: 0mm; Accuracy Percentage: 1%; Max Supply Voltage: 26V; Nominal Supply Current: 10-37mA; Number Of Outputs: 1; Dropout Voltage: 370mV; Min Supply Voltage: 2.25V; ComponentLink2URL: http://ww1.microchip.com/downloads/en/DeviceDoc/MIC2915x-30x-50x-75x-High-Current-Low-Dropout-Regulators-DS20005685B.pdf; Device Class L1: Integrated Circuits (ICs); Digikey Description: IC REG LINEAR POS ADJ 3A TO263-5; Device Class L2: Power Management ICs; Lead Free: Yes; Mouser Description: LDO Voltage Regulators; Package: C04-012; Temperature: -40°C to +125°C; ComponentLink2Description: Datasheet; Temperature Range High: +125°C; Automotive: No; Device Class L3: Voltage Regulators - Linear; Category: IC; Temperature Range Low: -40°C; RoHS: TRUE; Output Current: 3A; Octopart: https://octopart.com/mic29302wu-tr-microchip-66801318; Manufacturer Part Number: MIC29302WU-TR; Height: 0.2inch

## Nets that join several sheets
+3V3: sensor_sch (8 pins), voltage_regulators (C8.1 IC4.2 IC4.4 TP14.1)
+4V: sensor_sch (R1.2 TP1.1 U1.1), voltage_regulators (C3.1 C4.2 R9.2 U3.4)
+5V: sensor_sch (7 pins), voltage_regulators (C10.1 IC5.2 IC5.4 TP15.1)
+12V: sensor_sch (J2.1 J2.2 J3.1), voltage_regulators (9 pins)
GND: sensor_sch (19 pins), voltage_regulators (13 pins)